# EAGLE design PixArt-Wii_5V (EAGLE 5.11)
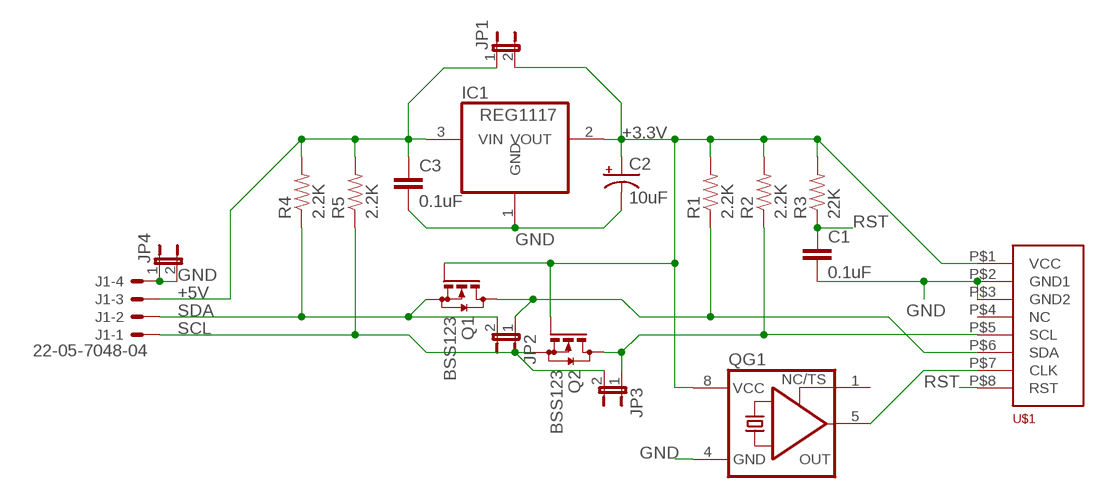
[diagram p0: schematic, sheet 1]

## Parts
C1  0.1uF  CAP1206  [1206]
C2  10uF  CAP_POL1206  [EIA3216]
C3  0.1uF  CAP1206  [1206]
IC1  REG1117  [SOT223]
J1  22-05-7048-04  [7395-04]
JP1  JUMPER-2PTH  [1X02]
JP2  JUMPER-2PTH  [1X02]
JP3  JUMPER-2PTH  [1X02]
JP4  JUMPER-2PTH  [1X02]
Q1  BSS123  [SOT23]
Q2  BSS123  [SOT23]
QG1  XO-8  [DIL08S]
R1  2.2K  RESISTOR1206  [1206]
R2  2.2K  RESISTOR1206  [1206]
R3  22K  RESISTOR1206  [1206]
R4  2.2K  RESISTOR1206  [1206]
R5  2.2K  RESISTOR1206  [1206]
U$1  PIXART_WII  [PIXART_WII]

## Nets
+3.3V: C2.A(+) IC1.2(VOUT) JP1.2 Q1.1(G) Q2.1(G) QG1.8(VCC) R1.2 R2.2 R3.2 U$1.P$1(VCC)
+5V: C3.1 IC1.3(VIN) J1.3 JP1.1 R4.2 R5.2
CLK: QG1.5(OUT) U$1.P$7(CLK)
GND: C1.2 C2.C(-) C3.2 IC1.1(GND) J1.4 JP4.1 JP4.2 QG1.4(GND) U$1.P$2(GND1) U$1.P$3(GND2)
RST: C1.1 R3.1 U$1.P$8(RST)
SCL: JP3.1 Q2.3(D) R2.1 U$1.P$5(SCL)
SCL5: J1.1 JP3.2 Q2.2(S) R5.1
SDA: JP2.1 Q1.3(D) R1.1 U$1.P$6(SDA)
SDA5: J1.2 JP2.2 Q1.2(S) R4.1
Unconnected: QG1.1(TS) U$1.P$4(NC)

## Library data of the parts
C1 C3 = SparkFun:CAP: Capacitor Standard 0603 ceramic capacitor, and 0.1" leaded capacitor.
C2 = SparkFun:CAP_POL: Capacitor Polarized These are standard SMD and PTH capacitors. Normally 10uF, 47uF, and 100uF in electrolytic and tantalum varieties. Always verify the external diameter of the through hole cap, it varies with capacity, voltage, and manufacturer. The EIA devices should be standard.
IC1 = burr-brown:REG1117: 800mA and 1A Low Dropout (LDO) Positive Regulator 1.8V, 2.5V, 2.85V, 3.3V, 5V, and Adj; MPN: REG1117; OC_FARNELL: 1097566; OC_NEWARK: 14P6981
J1 = con-molex:22-?-04: CONNECTOR wire to board 2.54 mm (.1 inch) pitch header; OC_FARNELL: unknown; OC_NEWARK: unknown
JP1-JP4 = SparkFun:JUMPER-2: Jumper Basic 0.1" spaced jumper. Use with breakaway headers.
Q1 Q2 = transistor-small-signal:BSS123: N-CHANNEL MOS FET
QG1 = crystal:XO-: CRYSTAL; OC_FARNELL: unknown; OC_NEWARK: unknown
R1-R5 = SparkFun:RESISTOR: Resistor Basic schematic elements and footprints for 0603, 1206, and PTH resistors.
U$1 = custom:PIXART_WII: Custom footprint for Wii PixArt Sensor.

## Board
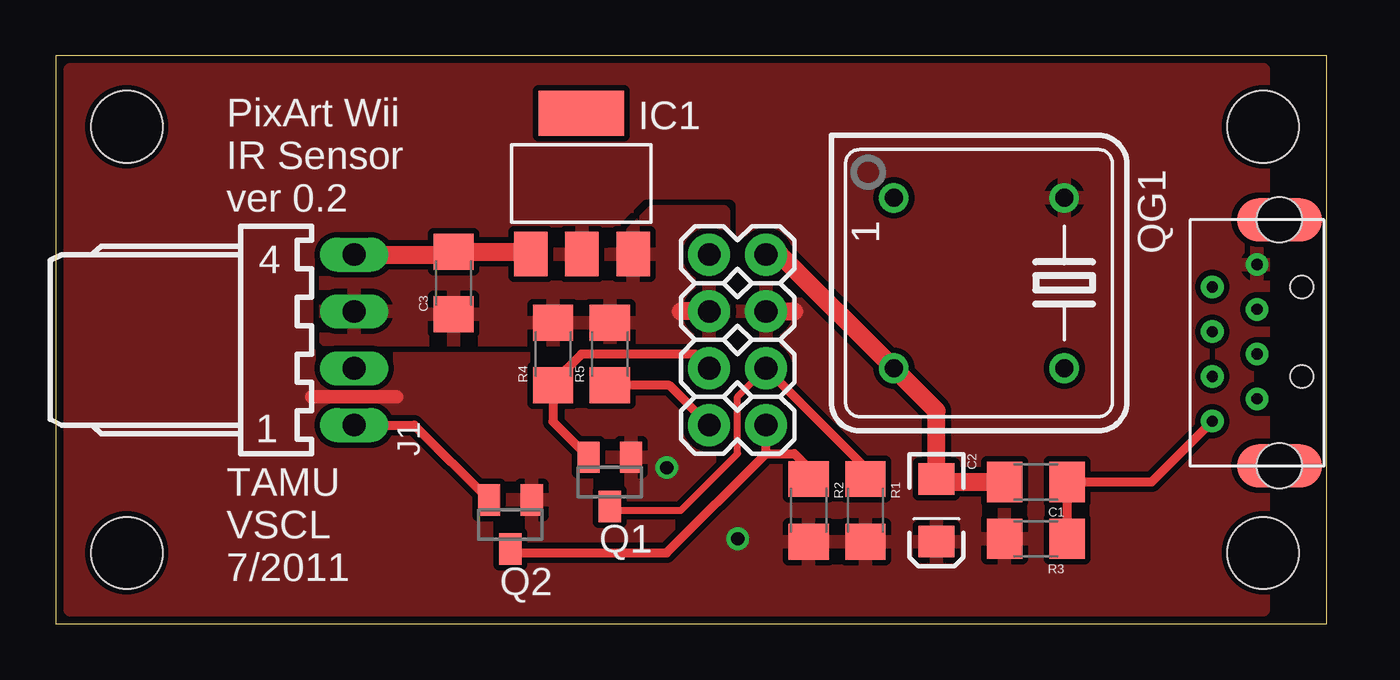
[diagram p1: board, top side]
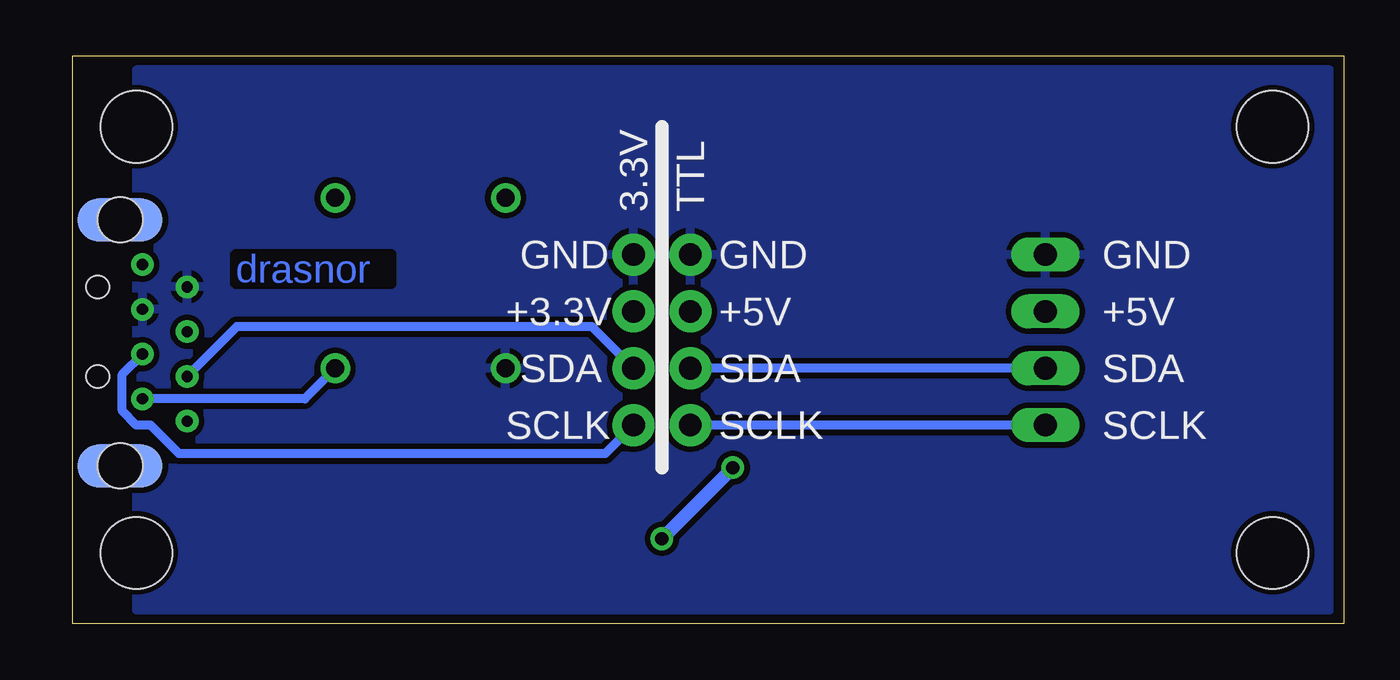
[diagram p2: board, bottom side, seen from below]

Size 56.82 x 25.39 mm. Coordinates in mm from the lower left corner, seen from the top.
Outline: 0,0 56.82,0 56.82,25.39 0,25.39 0,0
Copper layers (1*16): Top 0.0356mm / dielectric 1.6002mm / Bottom 0.0356mm
Design rules "advanced": minimum track width 6mil, minimum drill 15mil, track to track 6mil, track to pad 6mil, pad to pad 6mil, via to via 6mil, smd to smd 6mil, copper to edge 0mil, drill to drill 6mil, minimum pad ring 10mil, minimum via ring 8mil, stop-mask expansion 4mil, vias tented up to drill 0mil, thermal gap 10mil
Holes 3.2 mm at 3.17,22.23 3.17,3.17 53.98,3.17 53.98,22.23

### Footprints (pad centres in the part's own frame; a part is rotated, then mirrored left to right if it is on the bottom)
1206 = smd 1.6 x 1.8: 1 -1.4,0; 2 1.4,0
EIA3216 = smd 1.4 x 1.6: A 1.4,0; C -1.4,0
SOT223 = smd 1.499 x 2.007: 1 -2.261,-3.15; 2 0.025,-3.15; 3 2.311,-3.15 | smd 3.81 x 2.007: 4 0,3.15
7395-04 = drill 1.016 long: 1 3.81,0; 2 1.27,0; 3 -1.27,0; 4 -3.81,0
1X02 = drill 1.016 pad 1.88 round: 1 0,0; 2 2.54,0
SOT23 = smd 1 x 1.4: 1 -0.95,-1.1; 2 0.95,-1.1; 3 0,1.1
DIL08S = drill 0.813 round: 1 -3.81,-3.81; 4 3.81,-3.81; 5 3.81,3.81; 8 -3.81,3.81
PIXART_WII = drill 0.5 round: P$1 1,4; P$2 -1,3; P$3 1,2; P$4 -1,1; P$5 1,0; P$6 -1,-1; P$7 1,-2; P$8 -1,-3 | smd 3.81 x 1.93: P$9 2,-5; P$10 2,6 | smd 3.81 x 1.93 bottom: P$11 2,6; P$12 2,-5 | hole 1: 3,3; 3,-1 | hole 2: 2,6; 2,-5

### Placement (x,y rotation side)
C1  43.81,6.35 180 top
C2  39.37,5.08 270 top
C3  17.78,15.24 90 top
IC1  23.5,19.68 0 top
J1  13.34,12.7 270 top
JP1  29.21,13.97 0 top
JP2  31.75,11.43 180 top
JP3  31.75,8.89 180 top
JP4  29.21,16.51 0 top
Q1  24.77,6.35 180 top
Q2  20.32,4.45 180 top
QG1  41.27,15.24 270 top
R1  36.2,5.08 270 top
R2  33.66,5.08 270 top
R3  43.81,3.81 180 top
R4  22.23,12.06 90 top
R5  24.77,12.06 90 top
U$1  52.7,12.06 0 top

### Tracks (layer width: path | path; a pad name or v marks a point on that pad's centre or on a via)
+3.3V  (via drill 0.6)
  Top 0.61: 11.43,10.16 15.24,10.16
  Top 0.813: JP1.2 33.02,13.97
  Bottom 0.61: v27.3,6.99 v30.48,3.81
  pour Top (isolate 0.254, rank 3): 0.64,24.77 53.98,24.77 53.98,0.64 0.64,0.64
+5V
  Top 0.813: JP1.1 27.94,13.97
  pour Top (isolate 0.254, rank 2): 12.06,16.51 12.06,12.7 29.84,12.7 29.84,18.41 26.67,18.41 24.77,16.51
CLK
  Bottom 0.406: QG1.5 46.45,10.06 U$1.P$7
GND
  Top 0.406: 17.65,16.51 C3.2 | 21.13,16.64 IC1.1
  Top 0.813: J1.4 17.65,16.51 | C3.2 21.13,16.64 | JP4.2 32.38,16.51 QG1.4 39.37,9.53 C2.C 39.5,6.35 C1.2
  pour Bottom (isolate 0.254): 0.64,24.77 53.98,24.77 53.98,0.64 0.64,0.64
RST
  Top 0.406: R3.1 C1.1 48.99,6.35 U$1.P$8
SCL
  Top 0.406: R2.1 33.66,6.99 33.02,7.62 31.75,7.62 | Q2.3 20.49,3.17 27.3,3.17 31.75,7.62 | 31.75,7.62 JP3.1
  Bottom 0.406: JP3.1 33.02,7.62 52.07,7.62 53.34,8.89 53.98,8.89 54.61,9.53 54.61,11.16 U$1.P$5
SCL5
  Top 0.406: J1.1 16.02,8.89 Q2.2 | JP3.2 27.43,10.66 R5.1
  Bottom 0.406: J1.1 JP3.2
SDA
  Top 0.305: 24.93,5.08 27.94,5.08 30.48,7.62 30.48,10.16 JP2.1
  Top 0.406: JP2.1 36.2,6.99 R1.1 | Q1.3 24.93,5.08
  Bottom 0.406: U$1.P$6 49.48,13.29 33.61,13.29 JP2.1
SDA5
  Top 0.406: Q1.2 22.23,9.04 R4.1 22.23,10.79 23.5,12.06 28.57,12.06 JP2.2
  Bottom 0.406: J1.2 JP2.2

### Text on the board
Bottom: drasnor
tNames: PixArt Wii | IR Sensor | ver 0.2 | TAMU | VSCL | 7/2011
bNames: TTL | 3.3V | GND | GND | GND | +5V | +5V | +3.3V | SDA | SDA | SDA | SCLK | SCLK | SCLK